# Altium schematic sheet qudong.SchDoc
size 762 x 508 mm; PageSetup: Record=PageOptions|CenterHorizontal=True|CenterVertical=True|PrintScale=0.54|XCorrection=1.00|YCorrection=1.00|PrintKind=1|BorderSize=5000000|LeftOffset=0|BottomOffset=0|Orientation=2|PaperLength=1000|PaperWidth=1000|Scale=100|PaperSource=7|PrintQuality=-4|MediaType=1|DitherType=10|PaperKind=A3|PrintScaleMode=1
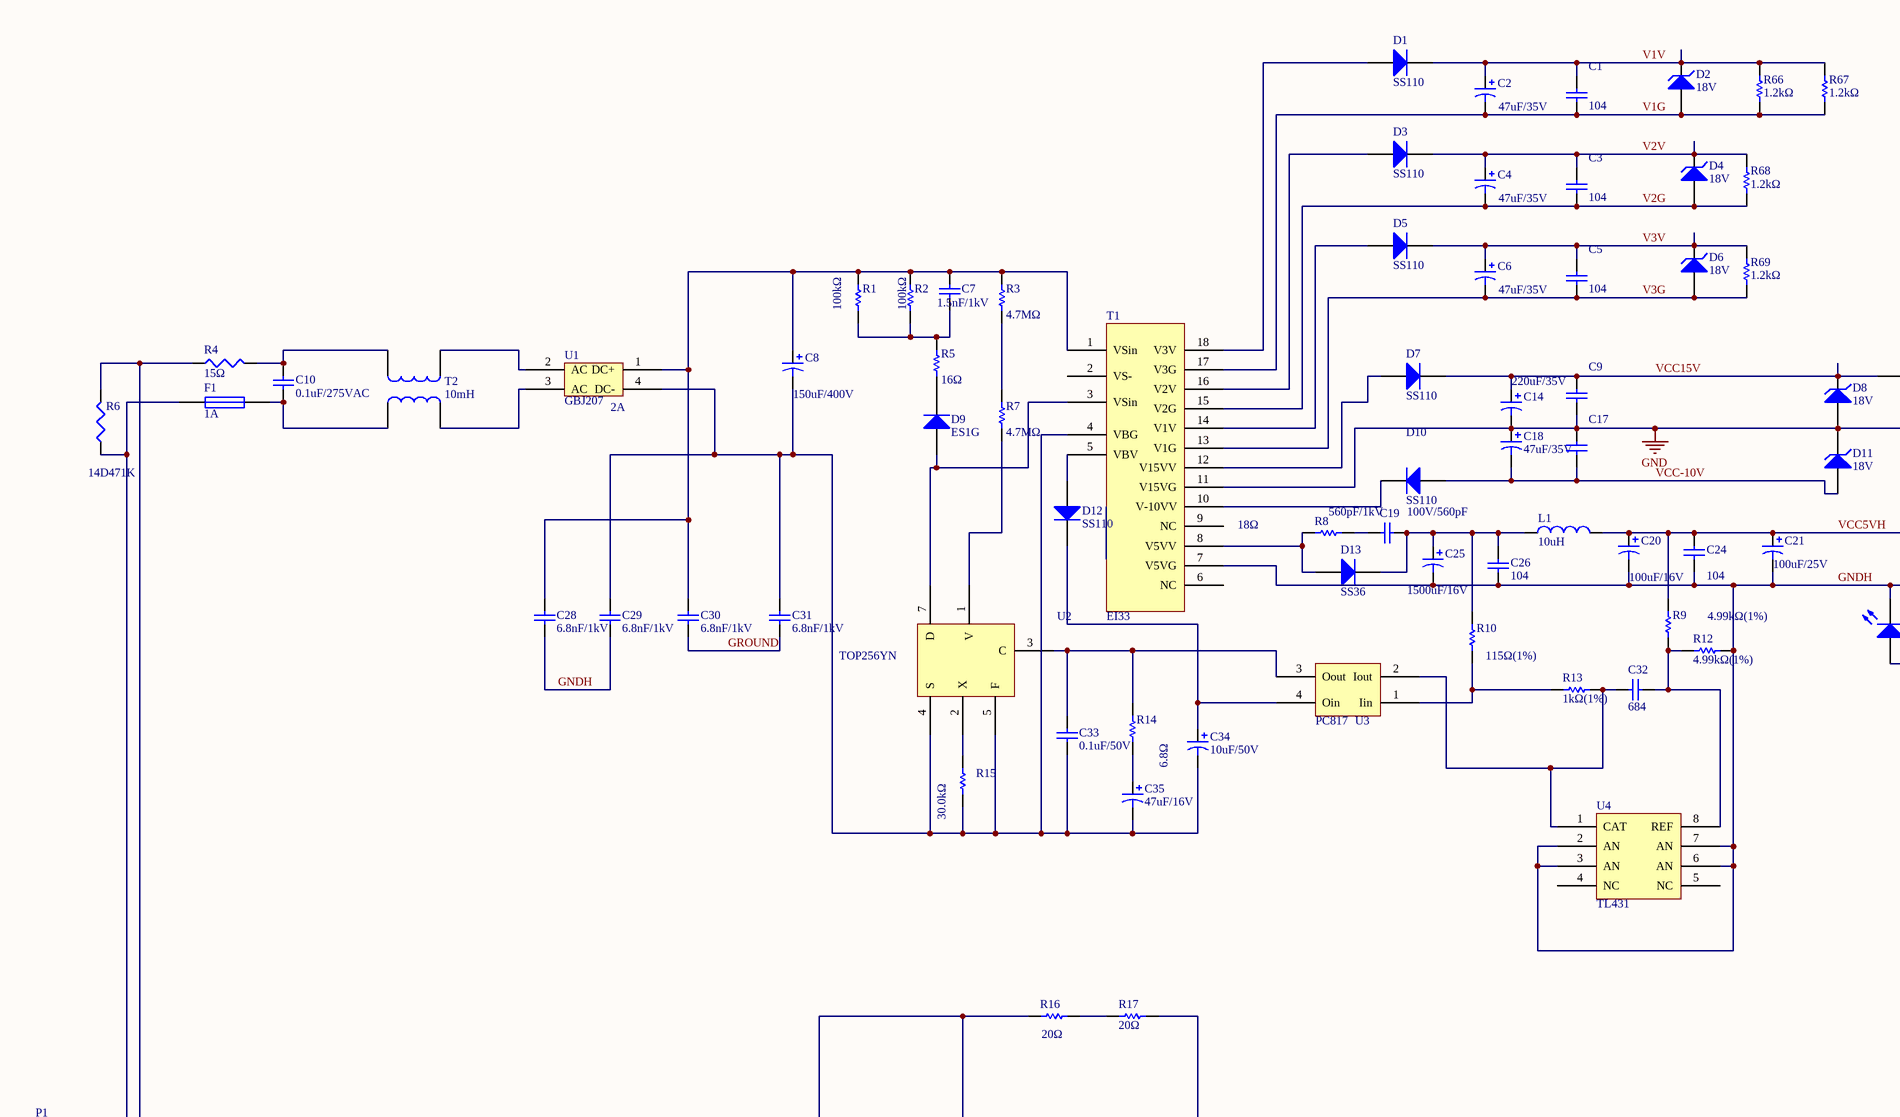
[diagram p0: qudong.SchDoc, top left]
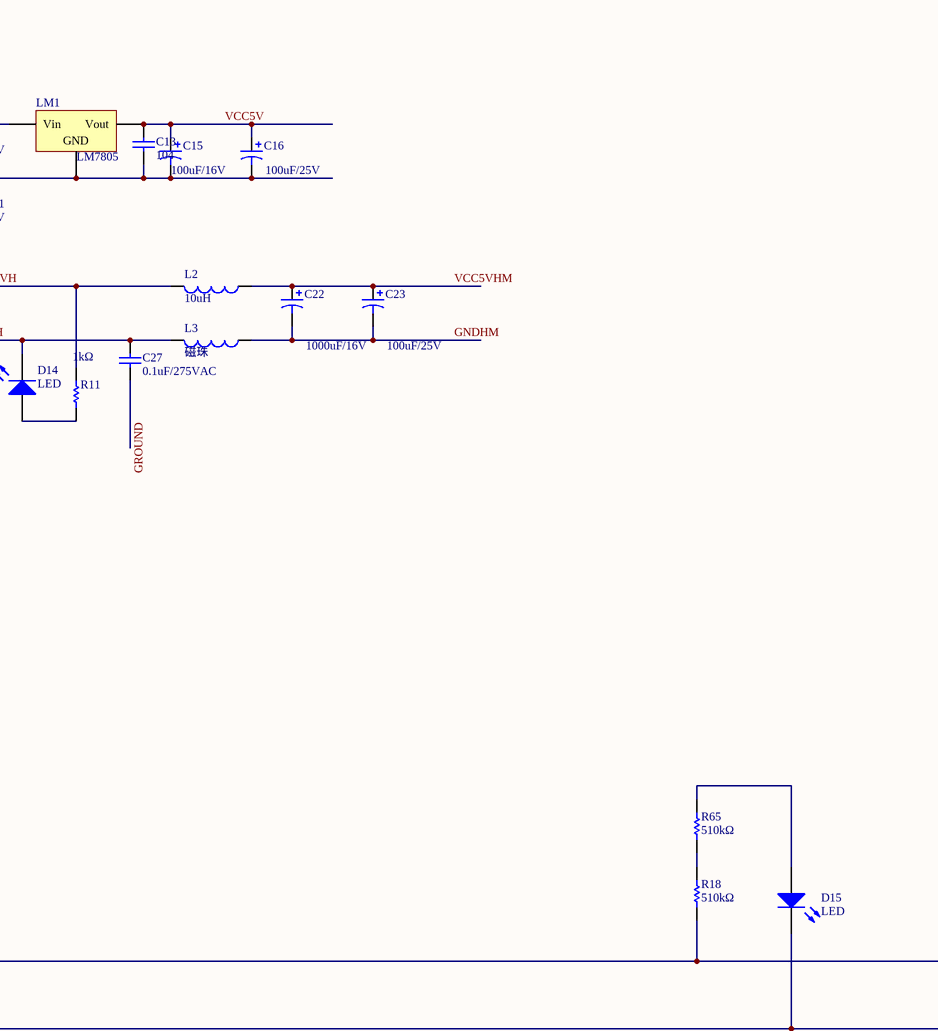
[diagram p1: qudong.SchDoc, top right]
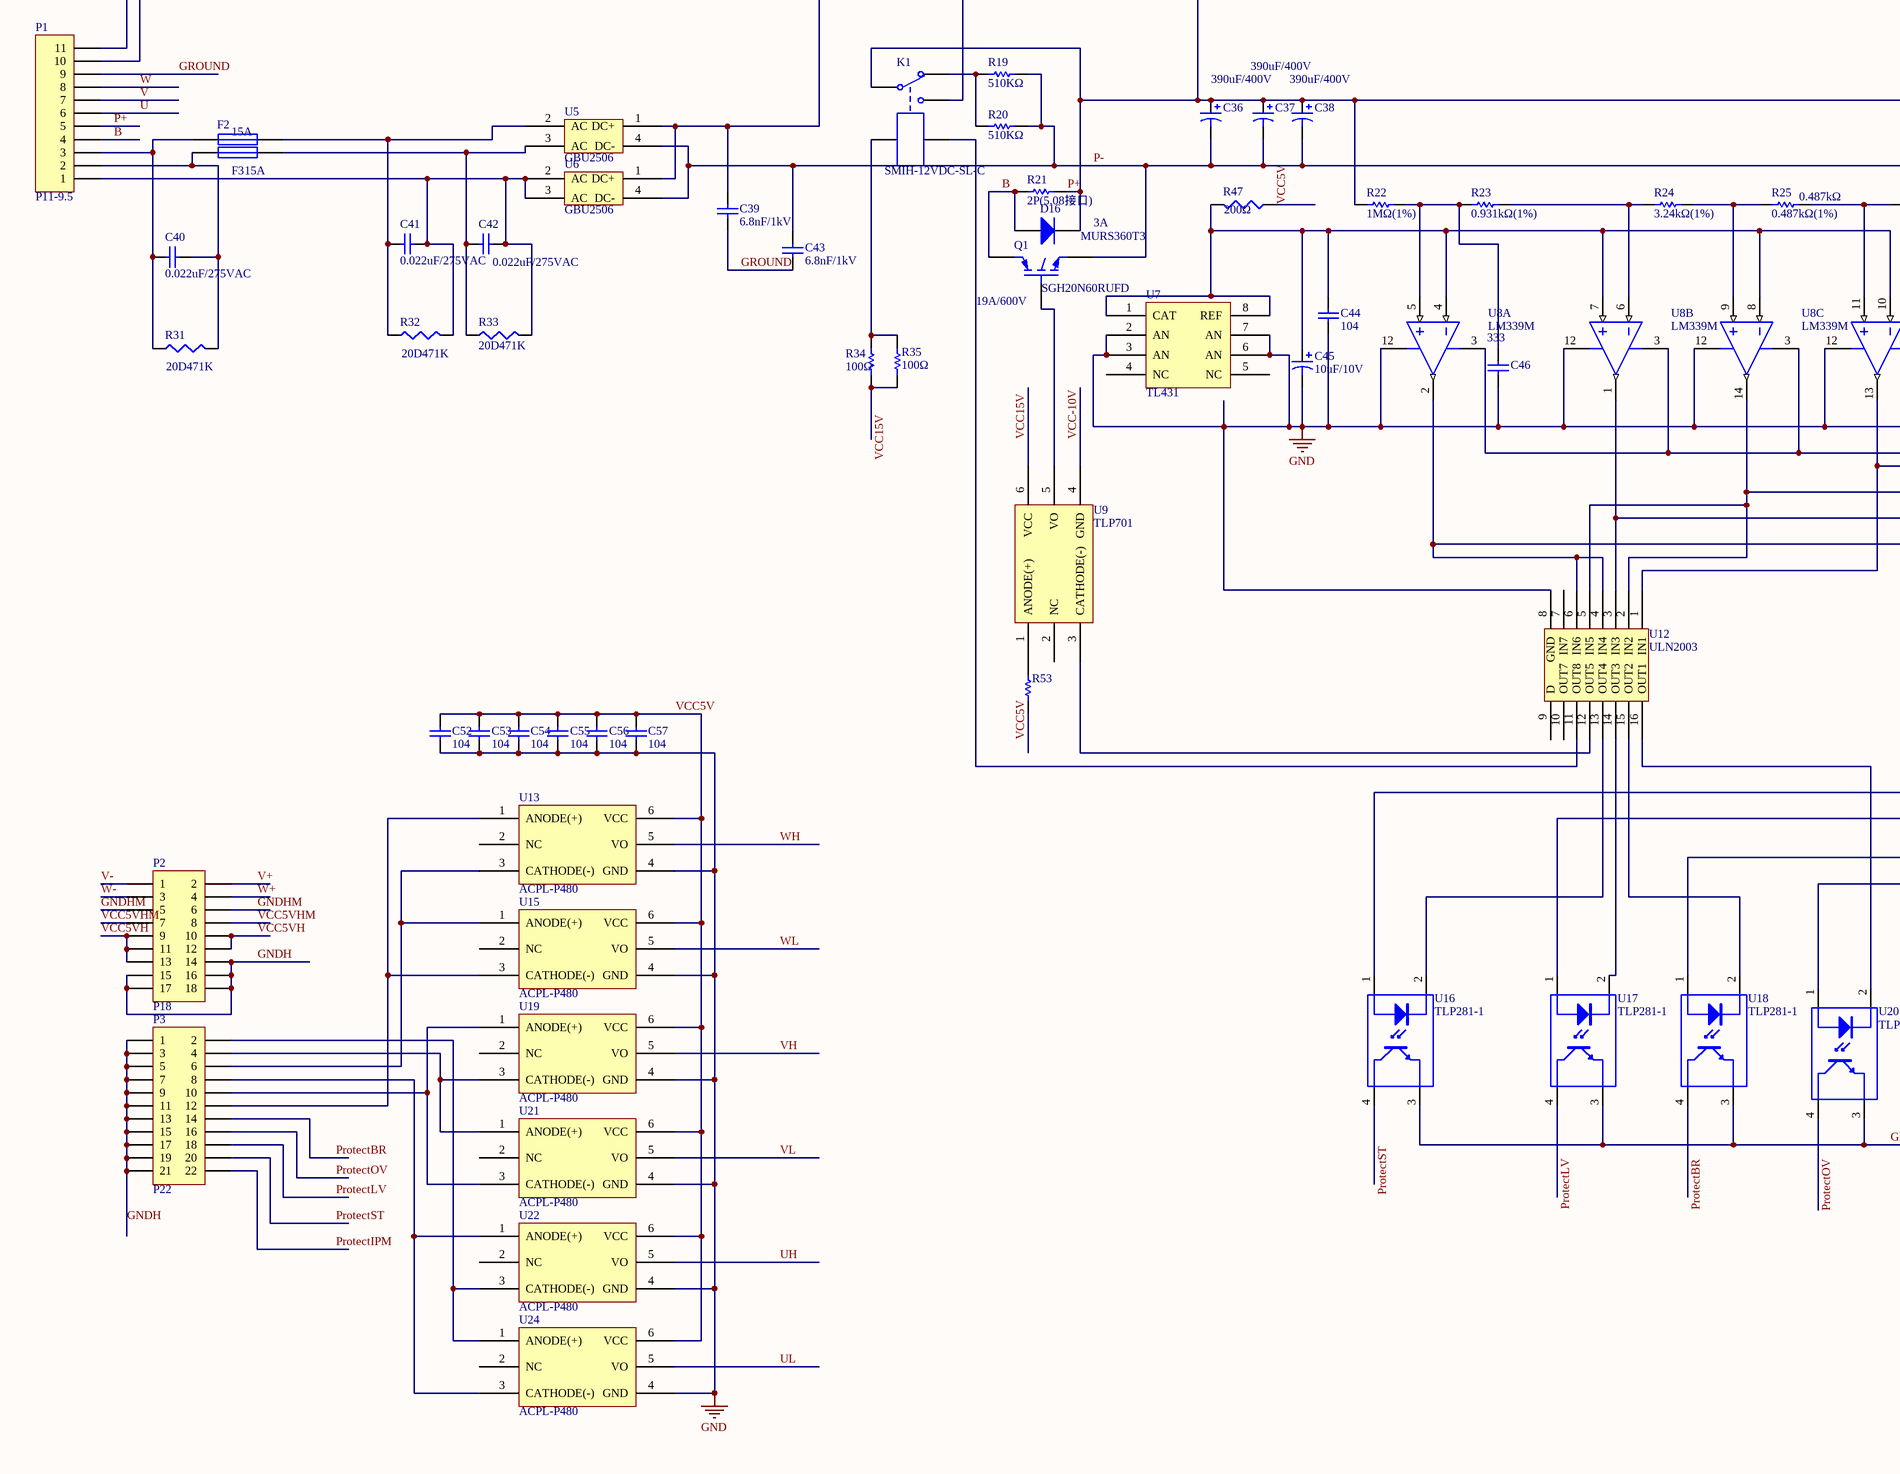
[diagram p2: qudong.SchDoc, bottom left]
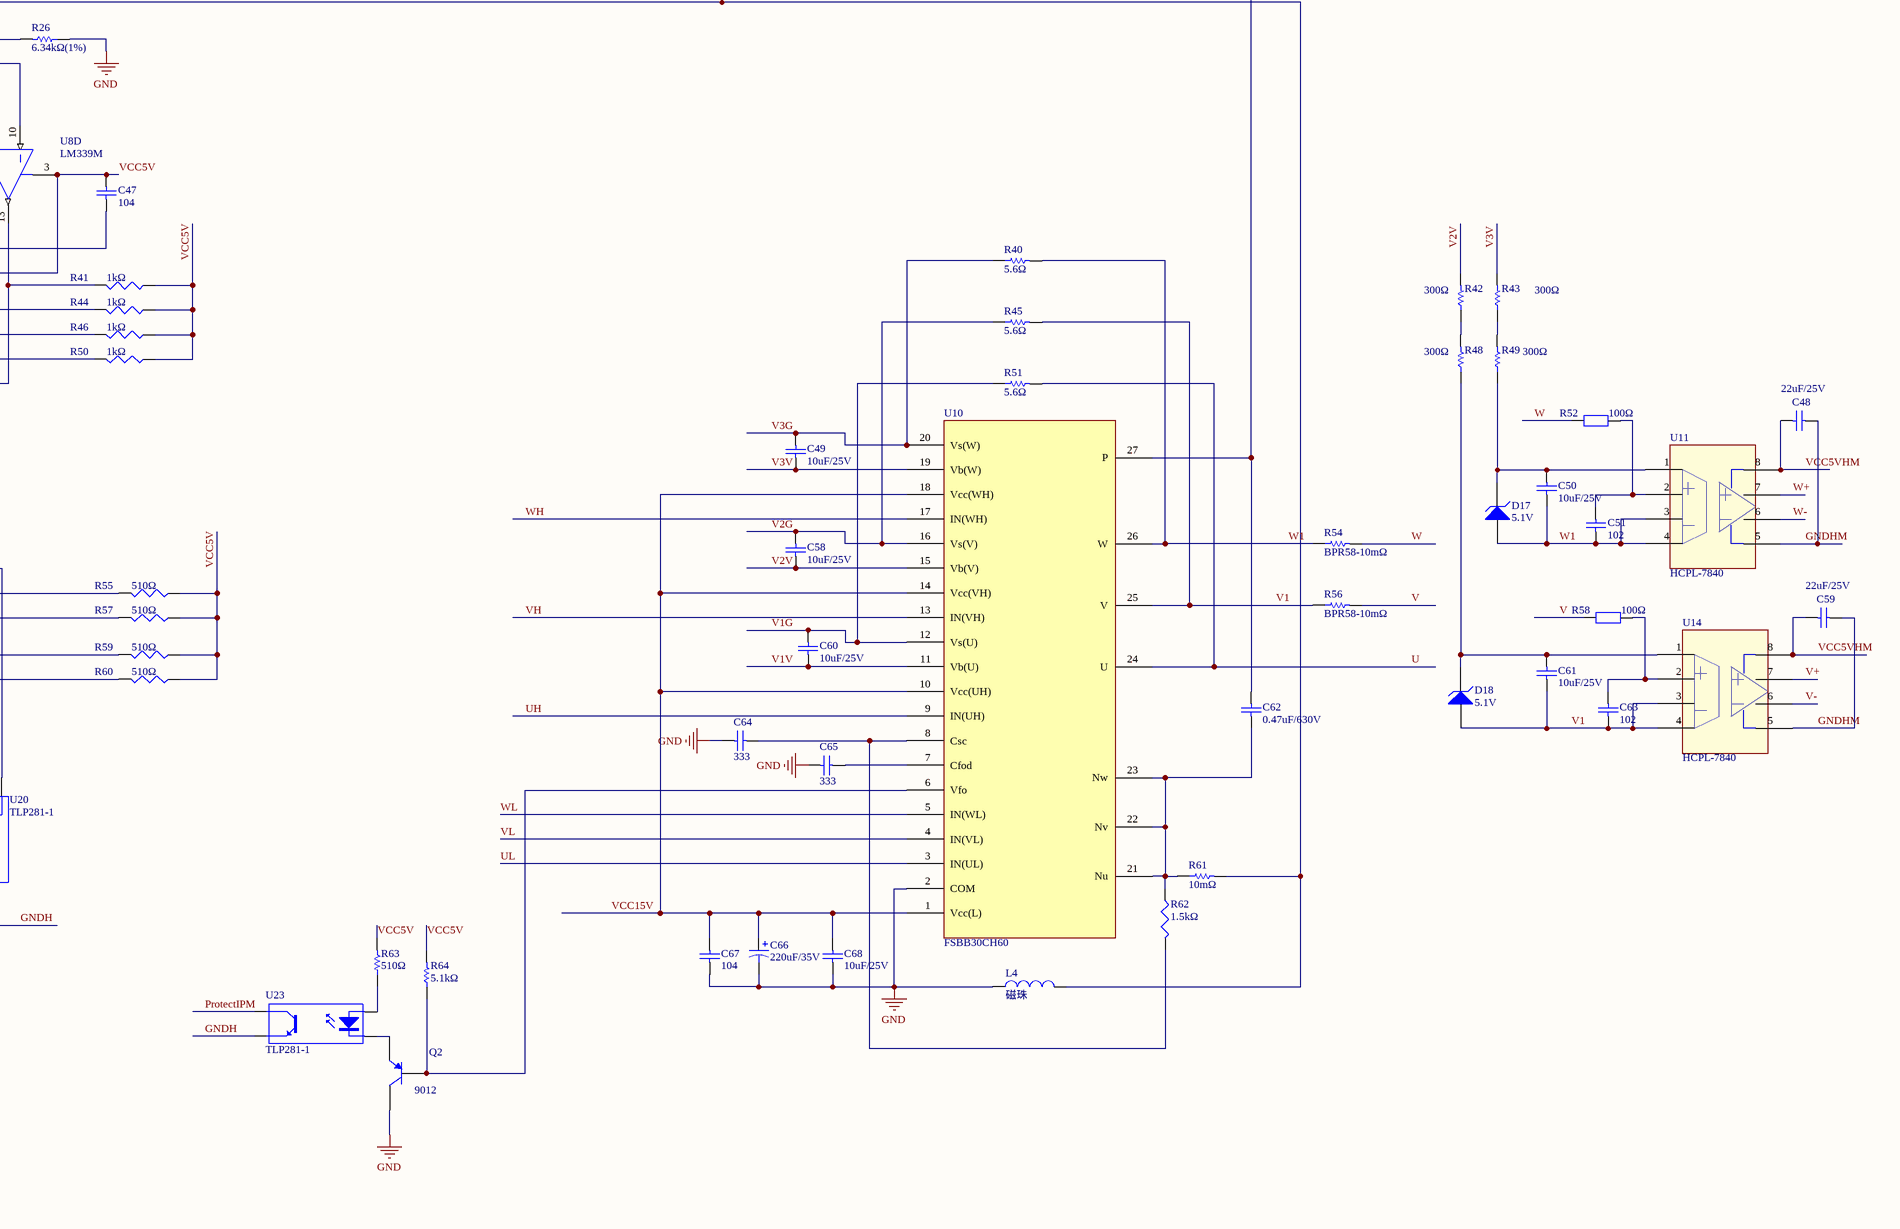
[diagram p3: qudong.SchDoc, bottom right]

## Parts
C1  104  [0805C]
C2  47uF/35V  [35V/220uF]
C3  104  [0805C]
C4  47uF/35V  [35V/220uF]
C5  104  [0805C]
C6  47uF/35V  [35V/220uF]
C7  1.5nF/1kV  [RAD-0.2]
C8  150uF/400V  [400V/100uF]
C9  104  [0805C]  (value not drawn)
C10  0.1uF/275VAC  [275AC/0.1F]
C13  104  [0805C]
C14  220uF/35V  [35V/1000uF]
C15  100uF/16V  [16V/1000uF]
C16  100uF/25V  [7343TAC]
C17  104  [0805C]  (value not drawn)
C18  47uF/35V  [35V/220uF]
C19  560pF/1kV  value 100V/560pF  [RAD-0.2]
C20  100uF/16V  [16V/3300uF]
C21  100uF/25V  [7343TAC]
C22  1000uF/16V  [16V/1000uF]
C23  100uF/25V  [7343TAC]
C24  104  [0805C]
C25  1500uF/16V  [16V/3300uF]
C26  104  [0805C]
C27  0.1uF/275VAC  [275AC/0.1F]
C28  6.8nF/1kV  [RAD-0.2]
C29  6.8nF/1kV  [RAD-0.2]
C30  6.8nF/1kV  [RAD-0.2]
C31  6.8nF/1kV  [RAD-0.2]
C32  684  [0805C]
C33  0.1uF/50V  [RAD-0.1]
C34  10uF/50V  [10uF~47uF]
C35  47uF/16V  [10uF~47uF]
C36  390uF/400V  [C470uF/400V]
C37  390uF/400V  [C470uF/400V]
C38  390uF/400V  [C470uF/400V]
C39  6.8nF/1kV  [RAD-0.2]
C40  0.022uF/275VAC  [275VAC223]
C41  0.022uF/275VAC  [275VAC223]
C42  0.022uF/275VAC  [275VAC223]
C43  6.8nF/1kV  [RAD-0.2]
C44  104  [0805C]
C45  10uF/10V  [10uF~47uF]
C46  333  [0805C]
C47  104  [0805C]
C48  22uF/25V  [1812C]
C49  10uF/25V  [1210C]
C50  10uF/25V  [1210C]
C51  102  [0805C]
C52  104  [0805C]
C53  104  [0805C]
C54  104  [0805C]
C55  104  [0805C]
C56  104  [0805C]
C57  104  [0805C]
C58  10uF/25V  [1210C]
C59  22uF/25V  [1812C]
C60  10uF/25V  [1210C]
C61  10uF/25V  [1210C]
C62  0.47uF/630V  [474/630V]
C63  102  [0805C]
C64  333  [0805C]
C65  333  [0805C]
C66  220uF/35V  [35V/220uF]
C67  104  [0805C]
C68  10uF/25V  [1210C]
D1  SS110  [DO214]
D2  18V  [DO214]
D3  SS110  [DO214]
D4  18V  [DO214]
D5  SS110  [DO214]
D6  18V  [DO214]
D7  SS110  [DO214]
D8  18V  [DO214]
D9  ES1G  [DO214]
D10  SS110  [DO214]
D11  18V  [DO214]
D12  SS110  [DO214]
D13  SS36  [MURS360T3]
D14  LED  [0805D]
D15  LED  [0805D]
D16  MURS360T3  value 3A  [MURS360T3]
D17  5.1V  [DO214]
D18  5.1V  [DO214]
F1  1A  [Fusesmall]
F2  15A  [FUSH_2cm]
F3  15A  [FUSH_2cm]
K1  SMIH-12VDC-SL-C  [SMIH-12VDC-SL-C]
L1  10uH  [L4.7uH]
L2  10uH  [L4.7uH]
L3  磁珠  [AXIAL-0.4]
L4  磁珠  [AXIAL-0.4]
LM1  LM7805  [LD1085]
P1  P11-9.5  [P11]
P2  P18  [FFC_1.0mm_18pin_直]
P3  P22  [FFC_1.0mm_22pin_直]
Q1  SGH20N60RUFD  value 19A/600V  [SFM-F3/Y2.3]
Q2  9012  [SOT23]
R1  100kΩ  [R_2W]
R2  100kΩ  [R_2W]
R3  value 4.7MΩ  [1206R]  (hidden comment: 2MΩ)
R4  15Ω  [AXIAL-0.3]
R5  16Ω  [1206R]
R6  14D471K  [14D471K]
R7  value 4.7MΩ  [1206R]  (hidden comment: 2MΩ)
R8  18Ω  [1206R]
R9  4.99kΩ(1%)  [0805R1%]
R10  115Ω(1%)  [0805R1%]
R11  1kΩ  [0805R]
R12  4.99kΩ(1%)  [0805R1%]
R13  1kΩ(1%)  [0805R1%]
R14  6.8Ω  [0805R]
R15  30.0kΩ  [0805R]
R16  20Ω  [remindianzu]
R17  20Ω  [remindianzu]
R18  510kΩ  [2010R]
R19  510KΩ  [R0.9]
R20  510KΩ  [R0.9]
R21  2P(5.08接口)  [2pz]
R22  1MΩ(1%)  [R0.9]
R23  0.931kΩ(1%)  [0805R1%]
R24  3.24kΩ(1%)  [0805R1%]
R25  0.487kΩ(1%)  value 0.487kΩ  [0805R1%]
R26  6.34kΩ(1%)  [0805R1%]
R31  20D471K  [14D471K]
R32  20D471K  [14D471K]
R33  20D471K  [14D471K]
R34  100Ω  [1206R]
R35  100Ω  [1206R]
R40  5.6Ω  [1206R]
R41  1kΩ  [0805R]
R42  300Ω  [1206R]
R43  300Ω  [1206R]
R44  1kΩ  [0805R]
R45  5.6Ω  [1206R]
R46  1kΩ  [0805R]
R47  200Ω  [1206R]
R48  300Ω  [1206R]
R49  300Ω  [1206R]
R50  1kΩ  [0805R]
R51  5.6Ω  [1206R]
R52  100Ω  [0805R]
R53  510Ω  [1206R]  (value not drawn)
R54  BPR58-10mΩ  [R0.02]
R55  510Ω  [0805R]
R56  BPR58-10mΩ  [R0.02]
R57  510Ω  [0805R]
R58  100Ω  [0805R]
R59  510Ω  [0805R]
R60  510Ω  [0805R]
R61  10mΩ  [R20mΩ]
R62  1.5kΩ  [1206R]
R63  510Ω  [0805R]
R64  5.1kΩ  [0805R]
R65  510kΩ  [2010R]
R66  1.2kΩ  [2010R]
R67  1.2kΩ  [2010R]
R68  1.2kΩ  [2010R]
R69  1.2kΩ  [2010R]
T1  EI33  [TRANFER]
T2  10mH  [CML]
U1  GBJ207  value 2A  [BRIDGE208]
U2  TOP256YN  [TOP256YN]
U3  PC817  [PC817]
U4  TL431  [SO8]
U5  GBU2506  [Bridge_8A]
U6  GBU2506  [Bridge_8A]
U7  TL431  [SO8]
U8  LM339M  [SO14]  (parts A,B,C,D of 4)
U9  TLP701  [ACPI-P480]
U10  FSBB30CH60  [FSBS10CH60]
U11  HCPL-7840  [HCPL7840]
U12  ULN2003  [SO16]
U13  ACPL-P480  [ACPI-P480]
U14  HCPL-7840  [HCPL7840]
U15  ACPL-P480  [ACPI-P480]
U16  TLP281-1  [TLP281]
U17  TLP281-1  [TLP281]
U18  TLP281-1  [TLP281]
U19  ACPL-P480  [ACPI-P480]
U20  TLP281-1  [TLP281]
U21  ACPL-P480  [ACPI-P480]
U22  ACPL-P480  [ACPI-P480]
U23  TLP281-1  [TLP281]
U24  ACPL-P480  [ACPI-P480]

## Nets
GND: C9.1 C13.1 C14.2 C15.2 C16.2 C17.2 C18.1 C44.1 C45.2 C46.2 C47.1 C52.1 C53.1 C54.1 C55.1 C56.1 C57.1 C64.2 C65.2 C66.2 C67.1 C68.1 D8.1(A) D11.2(K) L4.1 LM1.2(GND) Q2.3(C) R26.1 T1.11(V15VG) U7.2(AN) U7.3(AN) U7.6(AN) U7.7(AN) U8.12(GND) U10.2(COM) U12.8(GND) U13.4(GND) U15.4(GND) U19.4(GND) U21.4(GND) U22.4(GND) U24.4(GND)
B: D16.1(A) P1.4 Q1.2(C) R21.1
GNDH: C20.2 C21.2 C24.1 C25.2 C26.1 C27.1 C28.1 C29.1 D14.2(K) L3.2 P2.14 P2.15 P2.16 P2.17 P2.18 P3.1 P3.3 P3.5 P3.7 P3.9 P3.11 P3.13 P3.15 P3.17 P3.19 P3.21 R12.2 T1.7(V5VG) U4.2(AN) U4.3(AN) U4.6(AN) U4.7(AN) U16.3 U17.3 U18.3 U20.3 U23.3(E)
GNDHM: C22.2 C23.2 C48.1 C59.1 L3.1 P2.5 P2.6 U11.5 U14.5
GROUND: C27.2 C30.2 C31.2 C39.2 C43.2 P1.9
P+: C36.1 C37.1 C38.1 C62.2 D16.2(K) K1.1 P1.5 R17.1 R18.1 R21.2 R22.2 U10.27(P)
P-: C36.2 C37.2 C38.2 C43.1 D15.2(K) L4.2 Q1.3(E) R19.2 R20.2 R61.2 U5.4(DC-) U6.4(DC-)
ProtectBR: P3.14 U18.4
ProtectIPM: P3.22 U23.4(C)
ProtectLV: P3.18 U17.4
ProtectOV: P3.16 U20.4
ProtectST: P3.20 U16.4
U: P1.6 R51.2 U10.24(U)
UH: U10.9(IN(UH)) U22.5(VO)
UL: U10.3(IN(UL)) U24.5(VO)
V: P1.7 R56.2 R58.1
V1: C61.2 C63.2 D18.1(A) R45.2 R56.1 U10.25(V) U14.3 U14.4
V1G: C1.1 C2.2 C60.1 D2.1(A) R51.1 R66.1 R67.1 T1.17(V3G) U10.12(Vs(U))
V1V: C1.2 C2.1 C60.2 D1.2(K) D2.2(K) R66.2 R67.2 U10.11(Vb(U))
V2G: C3.1 C4.2 C58.2 D4.1(A) R45.1 R68.1 T1.15(V2G) U10.16(Vs(V))
V2V: C3.2 C4.1 C58.1 D3.2(K) D4.2(K) R42.2 R68.2 U10.15(Vb(V))
V3G: C5.1 C6.2 C49.1 D6.1(A) R40.1 R69.1 T1.13(V1G) U10.20(Vs(W))
V3V: C5.2 C6.1 C49.2 D5.2(K) D6.2(K) R43.2 R69.2 U10.19(Vb(W))
V+: P2.2 U14.7
V-: P2.1 U14.6
VCC5V: C13.2 C15.1 C16.1 C47.2 C52.2 C53.2 C54.2 C55.2 C56.2 C57.2 LM1.3(Vout) R41.1 R44.1 R46.1 R47.1 R50.1 R53.2 R55.1 R57.1 R59.1 R60.1 R63.2 R64.2 U8.3(V+) U13.6(VCC) U15.6(VCC) U19.6(VCC) U21.6(VCC) U22.6(VCC) U24.6(VCC)
VCC5VH: C20.1 C21.1 C24.2 L1.2 L2.2 P2.9 P2.10 P2.11 P2.12 P2.13 R9.2 R11.2
VCC5VHM: C22.1 C23.1 C48.2 C59.2 L2.1 P2.7 P2.8 U11.8 U14.8
VCC15V: C9.2 C14.1 C66.1 C67.2 C68.2 D7.2(K) D8.2(K) LM1.1(Vin) R34.2 R35.2 U9.6(VCC) U10.1(Vcc(L)) U10.10(Vcc(UH)) U10.14(Vcc(VH)) U10.18(Vcc(WH))
VCC-10V: C17.1 C18.2 D10.1(A) D11.1(A) U9.4(GND)
VH: U10.13(IN(VH)) U19.5(VO)
VL: U10.4(IN(VL)) U21.5(VO)
W: P1.8 R52.1 R54.2
W1: C50.2 C51.2 D17.1(A) R40.2 R54.1 U10.26(W) U11.3 U11.4
W+: P2.4 U11.7
W-: P2.3 U11.6
WH: U10.17(IN(WH)) U13.5(VO)
WL: U10.5(IN(WL)) U15.5(VO)
NetC7_1: C7.1 R1.1 R2.1 R5.2
NetC7_2: C7.2 C8.1 C28.2 C30.1 R1.2 R2.2 R3.2 T1.1(VSin) U1.1(DC+)
NetC8_2: C8.2 C29.2 C31.1 C33.1 C34.2 C35.2 R15.1 T1.4(VBG) U1.4(DC-) U2.4(S) U2.5(F)
NetC10_1: C10.1 F1.2 T2.1
NetC10_2: C10.2 R4.2 T2.3
NetC19_1: C19.1 C25.1 C26.2 D13.2(K) L1.1 R10.1
NetC19_2: C19.2 R8.1
NetC32_1: C32.1 R9.1 R12.1 U4.8(REF)
NetC32_2: C32.2 R13.2 U3.2(Iout) U4.1(CAT)
NetC33_2: C33.2 R14.2 U2.3(C) U3.3(Oout)
NetC34_1: C34.1 D12.2(K) U3.4(Oin)
NetC35_1: C35.1 R14.1
NetC39_1: C39.1 K1.3 R16.2 U5.1(DC+) U6.1(DC+)
NetC40_1: C40.1 F3.1 P1.2 R31.2
NetC40_2: C40.2 F2.1 P1.3 R31.1
NetC41_1: C41.1 C42.1 P1.1 R32.2 R33.2 U6.2(AC) U6.3(AC)
NetC41_2: C41.2 F2.2 R32.1 U5.2(AC)
NetC42_2: C42.2 F3.2 R33.1 U5.3(AC)
NetC44_2: C44.2 C45.1 R47.2 U7.1(CAT) U7.8(REF) U8.4(IN1-) U8.7(IN2+) U8.8(IN3-) U8.10(IN4-)
NetC46_1: C46.1 R22.1 R23.2 U8.5(IN1+)
NetC50_1: C50.1 D17.2(K) R49.1 U11.1
NetC51_1: C51.1 R52.2 U11.2
NetC61_1: C61.1 D18.2(K) R48.1 U14.1
NetC62_1: C62.1 R61.1 R62.1 U10.21(Nu) U10.22(Nv) U10.23(Nw)
NetC63_1: C63.1 R58.2 U14.2
NetC64_1: C64.1 R62.2 U10.8(Csc)
NetC65_1: C65.1 U10.7(Cfod)
NetD1_1: D1.1(A) T1.18(V3V)
NetD3_1: D3.1(A) T1.16(V2V)
NetD5_1: D5.1(A) T1.14(V1V)
NetD7_1: D7.1(A) T1.12(V15VV)
NetD9_1: D9.1(A) T1.3(VSin) U2.7(D)
NetD9_2: D9.2(K) R5.1
NetD10_2: D10.2(K) T1.10(V-10VV)
NetD12_1: D12.1(A) T1.5(VBV)
NetD13_1: D13.1(A) R8.2 T1.8(V5VV)
NetD14_1: D14.1(A) R11.1
NetD15_1: D15.1(A) R65.2
NetF1_1: F1.1 P1.11 R6.1
NetK1_2: K1.2 R19.1 R20.1
NetK1_4: K1.4 R34.1 R35.1
NetK1_5: K1.5 U12.11(OUT8)
NetP1_10: P1.10 R4.1 R6.2
NetP3_2: P3.2 U22.3(CATHODE(-)) U24.1(ANODE(+))
NetP3_4: P3.4 U19.3(CATHODE(-)) U21.1(ANODE(+))
NetP3_6: P3.6 U13.3(CATHODE(-)) U15.1(ANODE(+))
NetP3_8: P3.8 U22.1(ANODE(+)) U24.3(CATHODE(-))
NetP3_10: P3.10 U19.1(ANODE(+)) U21.3(CATHODE(-))
NetP3_12: P3.12 U13.1(ANODE(+)) U15.3(CATHODE(-))
NetQ1_1: Q1.1(G) U9.5(VO)
NetQ2_1: Q2.1(B) R64.1 U10.6(Vfo)
NetQ2_2: Q2.2(E) U23.2(K)
NetR3_1: R3.1 R7.2
NetR7_1: R7.1 U2.1(V)
NetR10_2: R10.2 R13.1 U3.1(Iin)
NetR15_2: R15.2 U2.2(X)
NetR16_1: R16.1 R17.2
NetR18_2: R18.2 R65.1
NetR23_1: R23.1 R24.2 U8.6(IN2-)
NetR24_1: R24.1 R25.2 U8.9(IN3+)
NetR25_1: R25.1 R26.2 U8.11(IN4+)
NetR41_2: R41.2 U8.13(OUT4) U12.1(IN1)
NetR42_1: R42.1 R48.2
NetR43_1: R43.1 R49.2
NetR44_2: R44.2 U8.14(OUT3) U12.2(IN2) U12.5(IN5)
NetR46_2: R46.2 U8.1(OUT2) U12.3(IN3)
NetR50_2: R50.2 U8.2(OUT1) U12.4(IN4) U12.6(IN6)
NetR53_1: R53.1 U9.1(ANODE(+))
NetR55_2: R55.2 U16.1
NetR57_2: R57.2 U17.1
NetR59_2: R59.2 U18.1
NetR60_2: R60.2 U20.1
NetR63_1: R63.1 U23.1(A)
NetT2_2: T2.2 U1.3(AC)
NetT2_4: T2.4 U1.2(AC)
NetU9_3: U9.3(CATHODE(-)) U12.12(OUT5)
NetU12_13: U12.13(OUT4) U16.2
NetU12_14: U12.14(OUT3) U17.2
NetU12_15: U12.15(OUT2) U18.2
NetU12_16: U12.16(OUT1) U20.2

Not connected (* = marked no-connect by the designer): T1 2(VS-) 6(NC) 9(NC); U4 4(NC) 5(NC); U7 4(NC) 5(NC); U9 2(NC); U12 7(IN7) 9(D) 10(OUT7); U13 2(NC); U15 2(NC); U19 2(NC); U21 2(NC); U22 2(NC); U24 2(NC)

## Library data of the parts
C1 C3 C5 C9 C13 C17 C24 C26 C32 C44 C46 C47 C51-C57 C63-C65 C67 = Cap: 贴片电容0805C; Published: 8-Jun-2000; LatestRevisionDate: 17-Jul-2002; LatestRevisionNote: Re-released for DXP Platform.; PackageReference: RAD-0.3; Publisher: Altium Limited
  C1 C3 C5 C9 C13 C17 C24 C26 C44 C47 C52-C57 C67: Value: 104
  C32: Value: 684
  C46 C64 C65: Value: 333
  C51 C63: Value: 102
C2 C4 C6 C18 = Cap Pol1: 电解电容; Value: 35V/47uF; Published: 8-Jun-2000; LatestRevisionDate: 17-Jul-2002; LatestRevisionNote: Re-released for DXP Platform.; PackageReference: RB7.6-15; Publisher: Altium Limited
C7 = Cap: 高压瓷片; Value: 1kV/4.7nF; Published: 8-Jun-2000; LatestRevisionDate: 17-Jul-2002; LatestRevisionNote: Re-released for DXP Platform.; PackageReference: RAD-0.3; Publisher: Altium Limited
C8 = Cap Pol1: 红宝石电解电容（控制回路主电容）; Value: 400V/150uF; Published: 8-Jun-2000; LatestRevisionDate: 17-Jul-2002; LatestRevisionNote: Re-released for DXP Platform.; PackageReference: RB7.6-15; Publisher: Altium Limited
C10 C27 = Cap: 安规电容; Value: 275VAC/0.1uF; Published: 8-Jun-2000; LatestRevisionDate: 17-Jul-2002; LatestRevisionNote: Re-released for DXP Platform.; PackageReference: RAD-0.3; Publisher: Altium Limited
C14 C66 = Cap Pol1: 电解电容; Value: 35V/220uF; Published: 8-Jun-2000; LatestRevisionDate: 17-Jul-2002; LatestRevisionNote: Re-released for DXP Platform.; PackageReference: RB7.6-15; Publisher: Altium Limited
C15 C20 = Cap Pol1: 电解电容; Value: 16V/100uF; Published: 8-Jun-2000; LatestRevisionDate: 17-Jul-2002; LatestRevisionNote: Re-released for DXP Platform.; PackageReference: RB7.6-15; Publisher: Altium Limited
C16 C21 C23 = Cap Pol1: 钽电容; Published: 8-Jun-2000; LatestRevisionDate: 17-Jul-2002; LatestRevisionNote: Re-released for DXP Platform.; PackageReference: RB7.6-15; Publisher: Altium Limited; Value: 100uF/25V
C19 = Cap: 高压瓷片; Published: 8-Jun-2000; LatestRevisionDate: 17-Jul-2002; LatestRevisionNote: Re-released for DXP Platform.; PackageReference: RAD-0.3; Publisher: Altium Limited
C22 = Cap Pol1: 电解电容; Value: 16V/1000uF; Published: 8-Jun-2000; LatestRevisionDate: 17-Jul-2002; LatestRevisionNote: Re-released for DXP Platform.; PackageReference: RB7.6-15; Publisher: Altium Limited
C25 = Cap Pol1: 电解电容; Value: 16V/1500uF; Published: 8-Jun-2000; LatestRevisionDate: 17-Jul-2002; LatestRevisionNote: Re-released for DXP Platform.; PackageReference: RB7.6-15; Publisher: Altium Limited
C28-C31 C39 C43 = Cap: 高压瓷片; Value: 1kV/6.8nF; Published: 8-Jun-2000; LatestRevisionDate: 17-Jul-2002; LatestRevisionNote: Re-released for DXP Platform.; PackageReference: RAD-0.3; Publisher: Altium Limited
C33 = Cap: 独石电容; Value: 50V/0.1uF; Published: 8-Jun-2000; LatestRevisionDate: 17-Jul-2002; LatestRevisionNote: Re-released for DXP Platform.; PackageReference: RAD-0.3; Publisher: Altium Limited
C34 = Cap Pol1: 电解电容; Value: 50V/10uF; Published: 8-Jun-2000; LatestRevisionDate: 17-Jul-2002; LatestRevisionNote: Re-released for DXP Platform.; PackageReference: RB7.6-15; Publisher: Altium Limited
C35 = Cap Pol1: 电解电容; Value: 10V/47uF; Published: 8-Jun-2000; LatestRevisionDate: 17-Jul-2002; LatestRevisionNote: Re-released for DXP Platform.; PackageReference: RB7.6-15; Publisher: Altium Limited
C36-C38 = Cap Pol1: 红宝石电解电容（主电容）; Value: 450V/330uF; Published: 8-Jun-2000; LatestRevisionDate: 17-Jul-2002; LatestRevisionNote: Re-released for DXP Platform.; PackageReference: RB7.6-15; Publisher: Altium Limited
C40-C42 = Cap: 安规电容; Value: 275VAC0.022uF; Published: 8-Jun-2000; LatestRevisionDate: 17-Jul-2002; LatestRevisionNote: Re-released for DXP Platform.; PackageReference: RAD-0.3; Publisher: Altium Limited
C45 = Cap Pol1: 电解电容; Value: 10V/10uF; Published: 8-Jun-2000; LatestRevisionDate: 17-Jul-2002; LatestRevisionNote: Re-released for DXP Platform.; PackageReference: RB7.6-15; Publisher: Altium Limited
C48 C59 = Cap: 贴片电容1812C; Published: 8-Jun-2000; LatestRevisionDate: 17-Jul-2002; LatestRevisionNote: Re-released for DXP Platform.; PackageReference: RAD-0.3; Publisher: Altium Limited; Value: 22uF/25V
C49 C50 C58 C60 C61 C68 = Cap: 贴片电容1210C; Published: 8-Jun-2000; LatestRevisionDate: 17-Jul-2002; LatestRevisionNote: Re-released for DXP Platform.; PackageReference: RAD-0.3; Publisher: Altium Limited; Value: 10uF/25V
C62 = Cap: 聚苯电容（CBB）; Value: 0.47uF/1200V; Published: 8-Jun-2000; LatestRevisionDate: 17-Jul-2002; LatestRevisionNote: Re-released for DXP Platform.; PackageReference: RAD-0.3; Publisher: Altium Limited
D1 D3 D5 D7 D10 D12 = Diode: ES1G; value: 1A; Published: 8-Jun-2000; LatestRevisionDate: 17-Jul-2002; LatestRevisionNote: Re-released for DXP Platform.; PackageVersion: Sep-1996; PackageReference: SMC; Publisher: Altium Limited; Code_JEDEC: DO-214-AB
D2 D4 D6 D8 D11 D17 D18 = D Zener: 稳压管; Published: 8-Jun-2000; LatestRevisionDate: 17-Jul-2002; LatestRevisionNote: Re-released for DXP Platform.; PackageReference: DIODE-0.7; Publisher: Altium Limited
D9 = Diode: value: 1A; Published: 8-Jun-2000; LatestRevisionDate: 17-Jul-2002; LatestRevisionNote: Re-released for DXP Platform.; PackageVersion: Sep-1996; PackageReference: SMC; Publisher: Altium Limited; Code_JEDEC: DO-214-AB
D13 = Diode: ES3B; value: 3A; Published: 8-Jun-2000; LatestRevisionDate: 17-Jul-2002; LatestRevisionNote: Re-released for DXP Platform.; PackageVersion: Sep-1996; PackageReference: SMC; Publisher: Altium Limited; Code_JEDEC: DO-214-AB
D14 D15 = LED1: 发光二极管; Published: 8-Jun-2000; LatestRevisionDate: 08-Jul-2005; LatestRevisionNote: Mech Layer 1 removed.; PackageReference: LED-1; Publisher: Altium Limited
D16 = Diode: Published: 8-Jun-2000; LatestRevisionDate: 17-Jul-2002; LatestRevisionNote: Re-released for DXP Platform.; PackageVersion: Sep-1996; PackageReference: SMC; Publisher: Altium Limited; Code_JEDEC: DO-214-AB
F1 = Fuse 1: 保险丝圆形; Published: 8-Jun-2000; LatestRevisionDate: 17-Jul-2002; LatestRevisionNote: Re-released for DXP Platform.; PackageReference: PIN-W2/E2.8; Publisher: Altium Limited; value: 1A
F2 F3 = Fuse 1: 保险丝25mm; Published: 8-Jun-2000; LatestRevisionDate: 17-Jul-2002; LatestRevisionNote: Re-released for DXP Platform.; PackageReference: PIN-W2/E2.8; Publisher: Altium Limited; value: 15A
K1 = Relay-SPDT: 继电器; value: 16A; Published: 24-Mar-1999; LatestRevisionDate: 17-Jul-2002; LatestRevisionNote: Re-released for DXP Platform.; PackageReference: MODULE5B; Publisher: Altium Limited
L1 L2 = Inductor: 工字电感; Code_IEC: 1005; Published: 8-Jun-2000; LatestRevisionDate: 17-Jul-2002; LatestRevisionNote: Re-released for DXP Platform.; PackageReference: 0402-A; Publisher: Altium Limited; Code_JEITA: 0402
  L1: Value: 10uH
L3 L4 = Inductor: Code_IEC: 1005; Published: 8-Jun-2000; LatestRevisionDate: 17-Jul-2002; LatestRevisionNote: Re-released for DXP Platform.; PackageReference: 0402-A; Publisher: Altium Limited; Code_JEITA: 0402
LM1 = Volt Reg: Published: 24-Mar-1999; LatestRevisionDate: 29-May-2009; LatestRevisionNote: IPC-7351 Footprint Added.; PackageReference: D2PAK; Publisher: Altium Limited; PackageDescription: 3-Pin Transistor Outline Package 2.54 mm Pitch, 15.1 mm Lead Span
P1 = Header 11: 45R-9.5mm-11P(主接口); LatestRevisionDate: 17-Jul-2002; LatestRevisionNote: Re-released for DXP Platform.; Publisher: Altium Limited
P2 = Header 9X2: 电源接口（软排线）; LatestRevisionDate: 17-Jul-2002; LatestRevisionNote: Re-released for DXP Platform.; Publisher: Altium Limited
P3 = Header 11X2: 数字接口（软排线）; LatestRevisionDate: 17-Jul-2002; LatestRevisionNote: Re-released for DXP Platform.; Publisher: Altium Limited
Q1 = IGBT-N: Published: 8-Jun-2000; LatestRevisionDate: 17-Jul-2002; LatestRevisionNote: Re-released for DXP Platform.; DatasheetVersion: PD-9.684A; PackageReference: TO-247; Publisher: Altium Limited; Code_JEDEC: TO-247-AC; ComponentLink1Description: Manufacturer Link; ComponentLink1URL: http://www.irf.com/
Q2 = 2N3906: 贴片三极管PNP; Published: 8-Jun-2000; LatestRevisionDate: 15-Jan-2003; LatestRevisionNote: PCB Footprint 'BCY-W3/D4.7' replaced; DatasheetVersion: 1997; PackageVersion: Sep-1998; PackageReference: TO-92A; Publisher: Altium Limited; Code_JEDEC: TO-92A; ComponentLink1Description: Manufacturer Link; ComponentLink1URL: http://www.fairchildsemi.com/; ComponentLink2Description: Datasheet; ComponentLink2URL: http://www.fairchildsemi.com/ds/2N%2F2N3906.pdf
R1 R2 = Res1: 2W直插碳膜电阻; Value: 36kΩ; Published: 8-Jun-2000; LatestRevisionDate: 17-Jul-2002; LatestRevisionNote: Re-released for DXP Platform.; PackageReference: AXIAL-0.3; Publisher: Altium Limited
R3 R5 R7 R8 R34 R35 R40 R42 R43 R45 R48 R49 R51 R53 = Res1: 贴片电阻1206R; Published: 8-Jun-2000; LatestRevisionDate: 17-Jul-2002; LatestRevisionNote: Re-released for DXP Platform.; PackageReference: AXIAL-0.3; Publisher: Altium Limited
  R5: Value: 16Ω
  R8: Value: 18Ω
  R34 R35: Value: 100Ω
  R40 R45 R51: Value: 5.6Ω
  R42 R43 R48 R49: Value: 300Ω
  R53: Value: 510Ω
R4 = Res3: 热敏电阻; Published: 8-Jun-2000; LatestRevisionDate: 29-May-2009; LatestRevisionNote: IPC-7351 Footprint Added.; PackageReference: J1-0603; Publisher: Altium Limited; PackageDescription: Chip Resistor; Value: 15Ω
R6 R31 R33 = Res3: 压敏电阻; Published: 8-Jun-2000; LatestRevisionDate: 29-May-2009; LatestRevisionNote: IPC-7351 Footprint Added.; PackageReference: J1-0603; Publisher: Altium Limited; PackageDescription: Chip Resistor
R9 R10 R12 R13 R23-R26 = Res1: 贴片电阻0805R（1%）; Published: 8-Jun-2000; LatestRevisionDate: 17-Jul-2002; LatestRevisionNote: Re-released for DXP Platform.; PackageReference: AXIAL-0.3; Publisher: Altium Limited
  R9 R12: Value: 4.99kΩ
  R10: Value: 115Ω
  R13: Value: 1kΩ
  R23: Value: 0.931kΩ
  R24: Value: 3.24kΩ
  R26: Value: 6.34kΩ
R11 R14 R15 R63 R64 = Res1: 贴片电阻0805R; Published: 8-Jun-2000; LatestRevisionDate: 17-Jul-2002; LatestRevisionNote: Re-released for DXP Platform.; PackageReference: AXIAL-0.3; Publisher: Altium Limited
  R11: Value: 1kΩ
  R14: Value: 6.8Ω
  R15: Value: 30.0kΩ
  R63: Value: 510Ω
  R64: Value: 5.1kΩ
R16 R17 = Res1: 热敏电阻; Published: 8-Jun-2000; LatestRevisionDate: 17-Jul-2002; LatestRevisionNote: Re-released for DXP Platform.; PackageReference: AXIAL-0.3; Publisher: Altium Limited; Value: 20Ω
R18 R65-R67 = Res1: 贴片电阻2010R; Published: 8-Jun-2000; LatestRevisionDate: 17-Jul-2002; LatestRevisionNote: Re-released for DXP Platform.; PackageReference: AXIAL-0.3; Publisher: Altium Limited
  R18 R65: Value: 510kΩ
  R66 R67: Value: 1.2kΩ
R19 R20 = Res1: 3W直插碳膜电阻; Published: 8-Jun-2000; LatestRevisionDate: 17-Jul-2002; LatestRevisionNote: Re-released for DXP Platform.; PackageReference: AXIAL-0.3; Publisher: Altium Limited; Value: 510KΩ
R21 = Res1: KF128绿端5.08-2P直; Value: 50Ω; Published: 8-Jun-2000; LatestRevisionDate: 17-Jul-2002; LatestRevisionNote: Re-released for DXP Platform.; PackageReference: AXIAL-0.3; Publisher: Altium Limited
R22 = Res1: 3W直插金属膜电阻（1%）; Published: 8-Jun-2000; LatestRevisionDate: 17-Jul-2002; LatestRevisionNote: Re-released for DXP Platform.; PackageReference: AXIAL-0.3; Publisher: Altium Limited; Value: 1MΩ
R32 = Res3: 压敏电阻; Value: 1K; Published: 8-Jun-2000; LatestRevisionDate: 29-May-2009; LatestRevisionNote: IPC-7351 Footprint Added.; PackageReference: J1-0603; Publisher: Altium Limited; PackageDescription: Chip Resistor
R41 R44 R46 R50 R55 R57 R59 R60 = Res3: 贴片电阻0805R; Published: 8-Jun-2000; LatestRevisionDate: 29-May-2009; LatestRevisionNote: IPC-7351 Footprint Added.; PackageReference: J1-0603; Publisher: Altium Limited; PackageDescription: Chip Resistor
  R41 R44 R46 R50: Value: 1kΩ
  R55 R57 R59 R60: Value: 510Ω
R47 R62 = Res3: 贴片电阻1206R; Published: 8-Jun-2000; LatestRevisionDate: 29-May-2009; LatestRevisionNote: IPC-7351 Footprint Added.; PackageReference: J1-0603; Publisher: Altium Limited; PackageDescription: Chip Resistor
  R47: Value: 200Ω
  R62: Value: 1.5kΩ
R52 R58 = Res2: 贴片电阻0805R; Published: 8-Jun-2000; LatestRevisionDate: 17-Jul-2002; LatestRevisionNote: Re-released for DXP Platform.; PackageReference: AXIAL-0.4; Publisher: Altium Limited; Value: 100Ω
R54 R56 = Res1: 采样电阻; Value: 10mΩ; Published: 8-Jun-2000; LatestRevisionDate: 17-Jul-2002; LatestRevisionNote: Re-released for DXP Platform.; PackageReference: AXIAL-0.3; Publisher: Altium Limited
R61 = Res1: 康铜电阻; Published: 8-Jun-2000; LatestRevisionDate: 17-Jul-2002; LatestRevisionNote: Re-released for DXP Platform.; PackageReference: AXIAL-0.3; Publisher: Altium Limited; Value: 10mΩ
R68 R69 = Res1: 贴片电阻; Published: 8-Jun-2000; LatestRevisionDate: 17-Jul-2002; LatestRevisionNote: Re-released for DXP Platform.; PackageReference: AXIAL-0.3; Publisher: Altium Limited; Value: 1.2kΩ
T1 = Tranfer: EI33变压器
T2 = Trans: 共模电感; Published: 24-Mar-1999; LatestRevisionDate: 08-Jul-2005; LatestRevisionNote: Mech Layer 1 removed.; PackageReference: TRANS; Publisher: Altium Limited; Value: 10mH
U1 = Bridge_8A: 整流桥
U4 U7 = TL431_SO8
U5 U6 = Bridge_8A: 整流桥; value: 25A
U8 = LM339M: Manufacturer: National Semiconductor; CompType: Amplifiers; PackageTopMarking: NSUZXYTT*LM339M; PowerWise: N; Published: 4-Dec-2008; DatasheetVersion: Mar-2004; PackageVersion: revJ, Jan-1996; PackageReference: M14A; Publisher: Altium Limited; PackageDescription: Molded Package S.O., .150in Wide, 14 Lead; PartNumber: LM339M; RoHS: O; PinCount: 14; DigiKeyPartNumber: LM339MXCT-ND; Code_JEDEC: MS-012AB; Code_IPC: SOIC127P600-14; ComponentLink1Description: LM339 Datasheet; ComponentLink1URL: http://www.national.com/ds/LM/LM339.pdf; ComponentLink2Description: LM339 Web Page; ComponentLink2URL: http://www.national.com/pf/LM/LM339.html; ComponentLink3Description: M14A Package Page; ComponentLink3URL: http://www.national.com/packaging/folders/m14a.html
U10 = IPM_FSBS10CH60: IPM_FSBB30CH60
U13 U15 U19 U21 U22 U24 = ACPI-P480
U16-U18 U20 = TLP181/PC357
U23 = Optoisolator1: Published: 24-Mar-1999; LatestRevisionDate: 04-Mar-2005; LatestRevisionNote: Sch pins 3 & 4 Swapped.; DatasheetVersion: Nov-2003; PackageReference: DIP-4; Publisher: Altium Limited